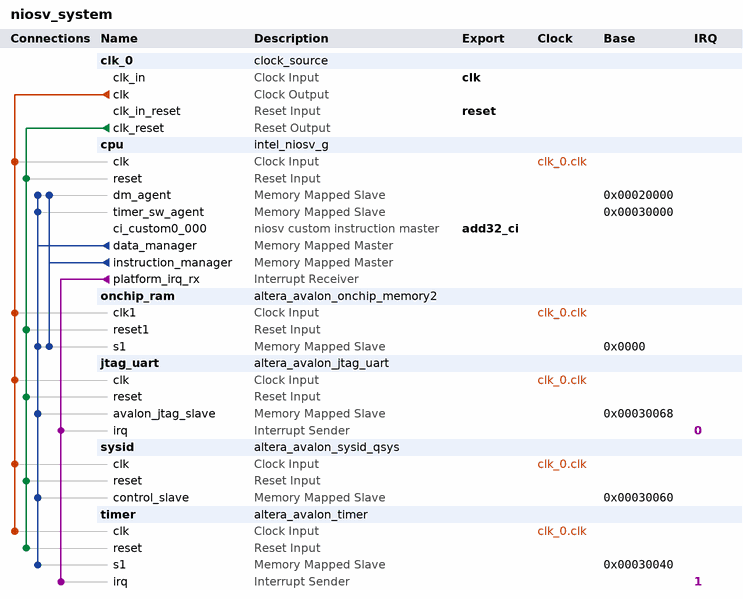
[diagram p0: system contents]
# Platform Designer (Qsys) system niosv_system, MAX 10 10M50DAF484C6GES
# Parameters at their usual value, and those the tool derives, are not listed.
package require -exact qsys 25.1
create_system niosv_system
set_project_property DEVICE_FAMILY {MAX 10}
set_project_property DEVICE 10M50DAF484C6GES

add_instance clk_0 clock_source 25.1
set_instance_parameter_value clk_0 clockFrequency 50000000

add_instance cpu intel_niosv_g 4.0.0
set_instance_parameter_value cpu Blind_Window_Period 1000
set_instance_parameter_value cpu CLICenabledInterruptMode 0
set_instance_parameter_value cpu CLICenabledShadowRegisterFiles 1
set_instance_parameter_value cpu CUSTOM_OP CUSTOM0
set_instance_parameter_value cpu Default_Timeout_Period 255
set_instance_parameter_value cpu SUB_OP 000
set_instance_parameter_value cpu alignCLICVectorTable 8
set_instance_parameter_value cpu basicInterruptMode 0
set_instance_parameter_value cpu basicShadowRegisterFiles 0
set_instance_parameter_value cpu clockFrequency 50000000
set_instance_parameter_value cpu dataCacheSize 4096
set_instance_parameter_value cpu disableFsqrtFdiv false
set_instance_parameter_value cpu dtcm1Base 0
set_instance_parameter_value cpu dtcm1Size 0
set_instance_parameter_value cpu dtcm2Base 0
set_instance_parameter_value cpu dtcm2Size 0
set_instance_parameter_value cpu enableBranchPrediction true
set_instance_parameter_value cpu enableCLICInterruptEdgeTriggerConfig false
set_instance_parameter_value cpu enableCLICInterruptPolarityConfig false
set_instance_parameter_value cpu enableCLICSelectiveHardwareVectoring false
set_instance_parameter_value cpu enableCoreLevelInterruptController false
set_instance_parameter_value cpu enableDebug true
set_instance_parameter_value cpu enableDebugReset false
set_instance_parameter_value cpu enableECCFull false
set_instance_parameter_value cpu enableECCLite false
set_instance_parameter_value cpu enableFPU false
set_instance_parameter_value cpu enableLockstep false
set_instance_parameter_value cpu enableLockstepExtRst false
set_instance_parameter_value cpu enableMulDiv true
set_instance_parameter_value cpu funct3 000
set_instance_parameter_value cpu funct7_l 0000
set_instance_parameter_value cpu funct7_u 000
set_instance_parameter_value cpu hartId 0
set_instance_parameter_value cpu instCacheSize 4096
set_instance_parameter_value cpu itcm1Base 0
set_instance_parameter_value cpu itcm1Size 0
set_instance_parameter_value cpu itcm2Base 0
set_instance_parameter_value cpu itcm2Size 0
set_instance_parameter_value cpu mnemonic ADD32
set_instance_parameter_value cpu numCLICDebugTriggers 0
set_instance_parameter_value cpu numCLICLevels 2
set_instance_parameter_value cpu numCLICPlatformInterrupts 16
set_instance_parameter_value cpu numCLICPriorities 8
set_instance_parameter_value cpu opcode CUSTOM0
set_instance_parameter_value cpu peripheralRegionABase 196608
set_instance_parameter_value cpu peripheralRegionASize 65536
set_instance_parameter_value cpu peripheralRegionBBase 0
set_instance_parameter_value cpu peripheralRegionBSize 0
set_instance_parameter_value cpu resetOffset 0
set_instance_parameter_value cpu resetSlave onchip_ram.s1
set_instance_parameter_value cpu useResetReq false

add_instance onchip_ram altera_avalon_onchip_memory2 25.1
set_instance_parameter_value onchip_ram dataWidth 32
set_instance_parameter_value onchip_ram dualPort false
set_instance_parameter_value onchip_ram initMemContent true
set_instance_parameter_value onchip_ram initializationFileName onchip_mem.hex
set_instance_parameter_value onchip_ram memorySize 131072

add_instance jtag_uart altera_avalon_jtag_uart 25.1
set_instance_parameter_value jtag_uart simInteractiveOptions NO_INTERACTIVE_WINDOWS

add_instance sysid altera_avalon_sysid_qsys 25.1
set_instance_parameter_value sysid id 1

add_instance timer altera_avalon_timer 25.1
set_instance_parameter_value timer period 1
set_instance_parameter_value timer periodUnits MSEC

# connections
add_connection clk_0.clk cpu.clk clock
add_connection clk_0.clk jtag_uart.clk clock
add_connection clk_0.clk onchip_ram.clk1 clock
add_connection clk_0.clk sysid.clk clock
add_connection clk_0.clk timer.clk clock
add_connection clk_0.clk_reset cpu.reset reset
add_connection clk_0.clk_reset jtag_uart.reset reset
add_connection clk_0.clk_reset onchip_ram.reset1 reset
add_connection clk_0.clk_reset sysid.reset reset
add_connection clk_0.clk_reset timer.reset reset
add_connection cpu.data_manager cpu.dm_agent avalon
set_connection_parameter_value cpu.data_manager/cpu.dm_agent baseAddress 0x00020000
add_connection cpu.data_manager cpu.timer_sw_agent avalon
set_connection_parameter_value cpu.data_manager/cpu.timer_sw_agent baseAddress 0x00030000
add_connection cpu.data_manager jtag_uart.avalon_jtag_slave avalon
set_connection_parameter_value cpu.data_manager/jtag_uart.avalon_jtag_slave baseAddress 0x00030068
add_connection cpu.data_manager onchip_ram.s1 avalon
set_connection_parameter_value cpu.data_manager/onchip_ram.s1 baseAddress 0x0000
add_connection cpu.data_manager sysid.control_slave avalon
set_connection_parameter_value cpu.data_manager/sysid.control_slave baseAddress 0x00030060
add_connection cpu.data_manager timer.s1 avalon
set_connection_parameter_value cpu.data_manager/timer.s1 baseAddress 0x00030040
add_connection cpu.instruction_manager cpu.dm_agent avalon
set_connection_parameter_value cpu.instruction_manager/cpu.dm_agent baseAddress 0x00020000
add_connection cpu.instruction_manager onchip_ram.s1 avalon
set_connection_parameter_value cpu.instruction_manager/onchip_ram.s1 baseAddress 0x0000
add_connection cpu.platform_irq_rx jtag_uart.irq interrupt
set_connection_parameter_value cpu.platform_irq_rx/jtag_uart.irq irqNumber 0
add_connection cpu.platform_irq_rx timer.irq interrupt
set_connection_parameter_value cpu.platform_irq_rx/timer.irq irqNumber 1

# exported interfaces
add_interface add32_ci niosv_custom_instruction start
set_interface_property add32_ci EXPORT_OF cpu.ci_custom0_000
add_interface clk clock sink
set_interface_property clk EXPORT_OF clk_0.clk_in
add_interface reset reset sink
set_interface_property reset EXPORT_OF clk_0.clk_in_reset

set_interconnect_requirement {$system} qsys_mm.clockCrossingAdapter HANDSHAKE
set_interconnect_requirement {$system} qsys_mm.enableEccProtection FALSE
set_interconnect_requirement {$system} qsys_mm.insertDefaultSlave FALSE
set_interconnect_requirement {$system} qsys_mm.maxAdditionalLatency 1

save_system niosv_system.qsys
